# Altium schematic sheet ecgschematic.SchDoc
size A
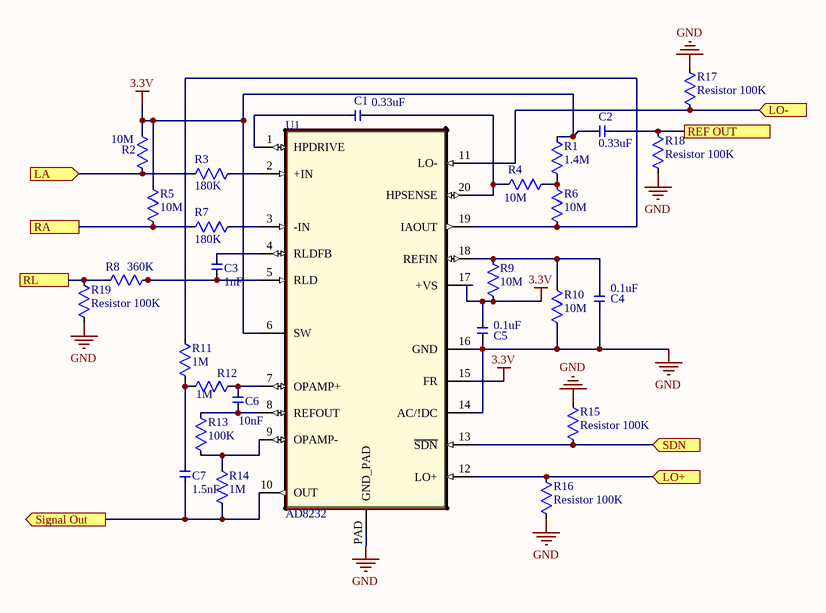
[diagram p0: ecgschematic.SchDoc]

## Parts
C1  0.33uF  [Cap 0.330uF]
C2  0.33uF  [Cap 0.330uF]
C3  1nF  [CAP 1nF]
C4  0.1uF  [CAP 0.1uF]
C5  0.1uF  [CAP 0.1uF]
C6  10nF  [CAP 10nF]
C7  1.5nF  [CAP 1.5nF]
R1  1.4M  [RESISTOR 1.4M]
R2  10M  [RESISTOR 10M]
R3  180K  [RESISTOR 180K]
R4  10M  [RESISTOR 10M]
R5  10M  [RESISTOR 10M]
R6  10M  [RESISTOR 10M]
R7  180K  [RESISTOR 180K]
R8  360K  [RESISTOR 360K]
R9  10M  [RESISTOR 10M]
R10  10M  [RESISTOR 10M]
R11  1M  [RESISTOR 1M]
R12  1M  [RESISTOR 1M]
R13  100K  [RESISTOR 100K]
R14  1M  [RESISTOR 1M]
R15  Resistor 100K  [RESISTOR 100K]
R16  Resistor 100K  [RESISTOR 100K]
R17  Resistor 100K  [RESISTOR 100K]
R18  Resistor 100K  [RESISTOR 100K]
R19  Resistor 100K  [RESISTOR 100K]
U1  AD8232  [*LFCSP_20_AD8232(Primary)]

## Ports
LA (in), LO+ (in), LO- (in), RA, REF OUT, RL, SDN (in), Signal Out (out)

## Nets
3.3V: C2.2 C5.1 R1.2 R2.2 R5.2 R9.1 U1.6(SW) U1.15(FR) U1.17(+VS)
GND: C4.2 C5.2 R10.1 R15.2 R16.1 R17.2 R18.1 R19.1 U1.14(AC/!DC) U1.16(GND) U1.PAD(GND_PAD)
LA: R2.1 R3.1 ; port LA
LO+: R16.2 U1.12(LO+) ; port LO+
LO-: R17.1 U1.11(LO-) ; port LO-
RA: R5.1 R7.1 ; port RA
REF OUT: C2.1 R18.2 ; port REF OUT
RL: R8.2 R19.2 ; port RL
SDN: R15.1 U1.13(~{SDN}) ; port SDN
Signal Out: C7.2 R14.1 U1.10(OUT) ; port Signal Out
NetC1_1: C1.1 R4.1 U1.20(HPSENSE)
NetC1_2: C1.2 U1.1(HPDRIVE)
NetC3_1: C3.1 U1.4(RLDFB)
NetC3_2: C3.2 R8.1 U1.5(RLD)
NetC4_1: C4.1 R9.2 R10.2 U1.18(REFIN)
NetC6_1: C6.1 R13.2 U1.8(REFOUT)
NetC6_2: C6.2 R12.2 U1.7(OPAMP+)
NetC7_1: C7.1 R11.1 R12.1
NetR1_1: R1.1 R4.2 R6.2
NetR3_2: R3.2 U1.2(+IN)
NetR6_1: R6.1 R11.2 U1.19(IAOUT)
NetR7_2: R7.2 U1.3(-IN)
NetR13_1: R13.1 R14.2 U1.9(OPAMP-)

## Library data of the parts
C1 C2 = Cap 0.33uF
C3 = Cap 1nF
C4 C5 = Cap 0.1uF
C6 = Cap 10nF
C7 = Cap 1.5nF
R1 = Resistor 1.4M
R2 R4-R6 R9 R10 = Resistor 10M
R3 R7 = Resistor 180K
R8 = Resistor 360K
R11 R12 R14 = Resistor 1M
R13 = Resistor 100K
U1 = AD8232: ECG Front End 20-LFCSP-WQ _4x4_; MF: Analog Devices; Package: LFCSP-20 Analog Devices; MP: AD8232; SnapEDA_Link: https://www.snapeda.com/parts/AD8232/Analog%20Devices/view-part/4218063/?ref=snap; Price: None; Availability: Unavailable; Value: *